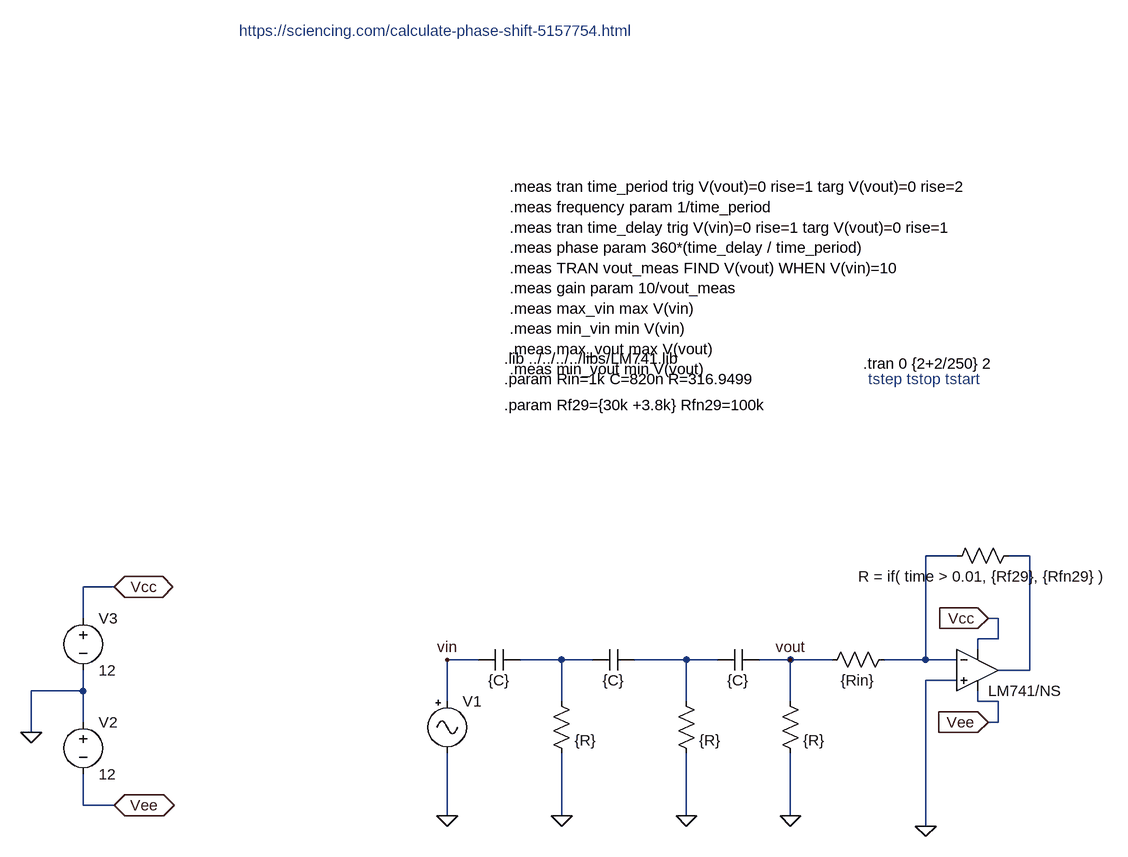
[diagram p0: schematic debugB_theorical.asc]
debugB_theorical.asc, the LTspice schematic file:
Version 4
SHEET 1 1428 1128
WIRE 592 -128 544 -128
WIRE 704 -128 672 -128
WIRE -704 -80 -752 -80
WIRE -752 -32 -752 -80
WIRE 656 -32 640 -32
WIRE 656 0 656 -32
WIRE 656 0 624 0
WIRE 624 16 624 0
WIRE -144 32 -192 32
WIRE -16 32 -80 32
WIRE 32 32 -16 32
WIRE 176 32 96 32
WIRE 224 32 176 32
WIRE 336 32 288 32
WIRE 400 32 336 32
WIRE 544 32 544 -128
WIRE 544 32 480 32
WIRE 592 32 544 32
WIRE 704 48 704 -128
WIRE 704 48 656 48
WIRE 592 64 544 64
WIRE -752 80 -752 48
WIRE -752 80 -832 80
WIRE -192 96 -192 32
WIRE -16 96 -16 32
WIRE 176 96 176 32
WIRE 336 96 336 32
WIRE 624 96 624 80
WIRE 656 96 624 96
WIRE -752 128 -752 80
WIRE 656 128 656 96
WIRE 656 128 640 128
WIRE -832 144 -832 80
WIRE -752 256 -752 208
WIRE -704 256 -752 256
WIRE -192 272 -192 176
WIRE -16 272 -16 176
WIRE 176 272 176 176
WIRE 336 272 336 176
WIRE 544 288 544 64
FLAG -16 272 0
FLAG 176 272 0
FLAG 640 -32 Vcc
IOPIN 640 -32 In
FLAG 640 128 Vee
IOPIN 640 128 In
FLAG 544 288 0
FLAG 336 272 0
FLAG -832 144 0
FLAG -704 -80 Vcc
IOPIN -704 -80 BiDir
FLAG -704 256 Vee
IOPIN -704 256 BiDir
FLAG 336 32 vout
FLAG -192 32 vin
FLAG -192 272 0
SYMBOL opamp2 624 -16 R0
WINDOW 0 16 32 Invisible 2
SYMATTR InstName U1
SYMATTR Value LM741/NS
SYMBOL res 688 -144 R90
WINDOW 0 0 56 Invisible 2
WINDOW 3 32 56 VTop 2
SYMATTR InstName R1
SYMATTR Value R = if( time > 0.01, {Rf29}, {Rfn29} )
SYMBOL res 496 16 R90
WINDOW 0 0 56 Invisible 2
WINDOW 3 32 56 VTop 2
SYMATTR InstName R2
SYMATTR Value {Rin}
SYMBOL cap -80 16 R90
WINDOW 0 0 32 Invisible 2
WINDOW 3 32 32 VTop 2
SYMATTR InstName C1
SYMATTR Value {C}
SYMBOL cap 96 16 R90
WINDOW 0 0 32 Invisible 2
WINDOW 3 32 32 VTop 2
SYMATTR InstName C2
SYMATTR Value {C}
SYMBOL cap 288 16 R90
WINDOW 0 0 32 Invisible 2
WINDOW 3 32 32 VTop 2
SYMATTR InstName C3
SYMATTR Value {C}
SYMBOL res -32 80 R0
WINDOW 0 36 40 Invisible 2
SYMATTR InstName R3
SYMATTR Value {R}
SYMBOL res 160 80 R0
WINDOW 0 36 40 Invisible 2
SYMATTR InstName R4
SYMATTR Value {R}
SYMBOL res 320 80 R0
WINDOW 0 36 40 Invisible 2
SYMATTR InstName R5
SYMATTR Value {R}
SYMBOL voltage -752 112 R0
SYMATTR InstName V2
SYMATTR Value 12
SYMBOL voltage -752 -48 R0
SYMATTR InstName V3
SYMATTR Value 12
SYMBOL Misc/signal -192 80 R0
WINDOW 3 24 104 Invisible 2
SYMATTR Value SINE(0 10.82 263.325)
SYMATTR InstName V1
TEXT -104 -432 Left 2 !.lib ../../../../libs/LM741.lib
TEXT -104 -400 Left 2 !.param Rin=1k C=820n R=316.9499
TEXT 448 -424 Left 2 !.tran 0 {2+2/250} 2
TEXT 456 -400 Left 2 ;tstep tstop tstart
TEXT -104 -360 Left 2 !.param Rf29={30k +3.8k} Rfn29=100k
TEXT -96 -696 Left 2 !.meas tran time_period trig V(vout)=0 rise=1 targ V(vout)=0 rise=2\n.meas frequency param 1/time_period\n.meas tran time_delay trig V(vin)=0 rise=1 targ V(vout)=0 rise=1\n.meas phase param 360*(time_delay / time_period)\n.meas TRAN vout_meas FIND V(vout) WHEN V(vin)=10\n.meas gain param 10/vout_meas\n.meas max_vin max V(vin)\n.meas min_vin min V(vin)\n.meas max_vout max V(vout)\n.meas min_vout min V(vout)
TEXT -512 -936 Left 2 ;https://sciencing.com/calculate-phase-shift-5157754.html

The netlist it stands for:
* debugB_theorical.asc
XU1 0 N001 Vcc Vee N002 LM741/NS  ; pins In+ In- V+ V- OUT
R1 N002 N001 R = if( time > 0.01, {Rf29}, {Rfn29} )
R2 N001 vout {Rin}
C1 N003 vin {C}
C2 N004 N003 {C}
C3 vout N004 {C}
R3 N003 0 {R}
R4 N004 0 {R}
R5 vout 0 {R}
V2 0 Vee 12
V3 Vcc 0 12
V1 vin 0 SINE(0 10.82 263.325)
.lib ../../../../libs/LM741.lib
.param Rin=1k C=820n R=316.9499
.tran 0 {2+2/250} 2
* tstep tstop tstart
.param Rf29={30k +3.8k} Rfn29=100k
.meas tran time_period trig V(vout)=0 rise=1 targ V(vout)=0 rise=2
.meas frequency param 1/time_period
.meas tran time_delay trig V(vin)=0 rise=1 targ V(vout)=0 rise=1
.meas phase param 360*(time_delay / time_period)
.meas TRAN vout_meas FIND V(vout) WHEN V(vin)=10
.meas gain param 10/vout_meas
.meas max_vin max V(vin)
.meas min_vin min V(vin)
.meas max_vout max V(vout)
.meas min_vout min V(vout)
* https://sciencing.com/calculate-phase-shift-5157754.html
.backanno
.end